# Altium project Grand Prix High Power Amp Board Rev 1.0.0.PrjPcb (part 1 of 2)
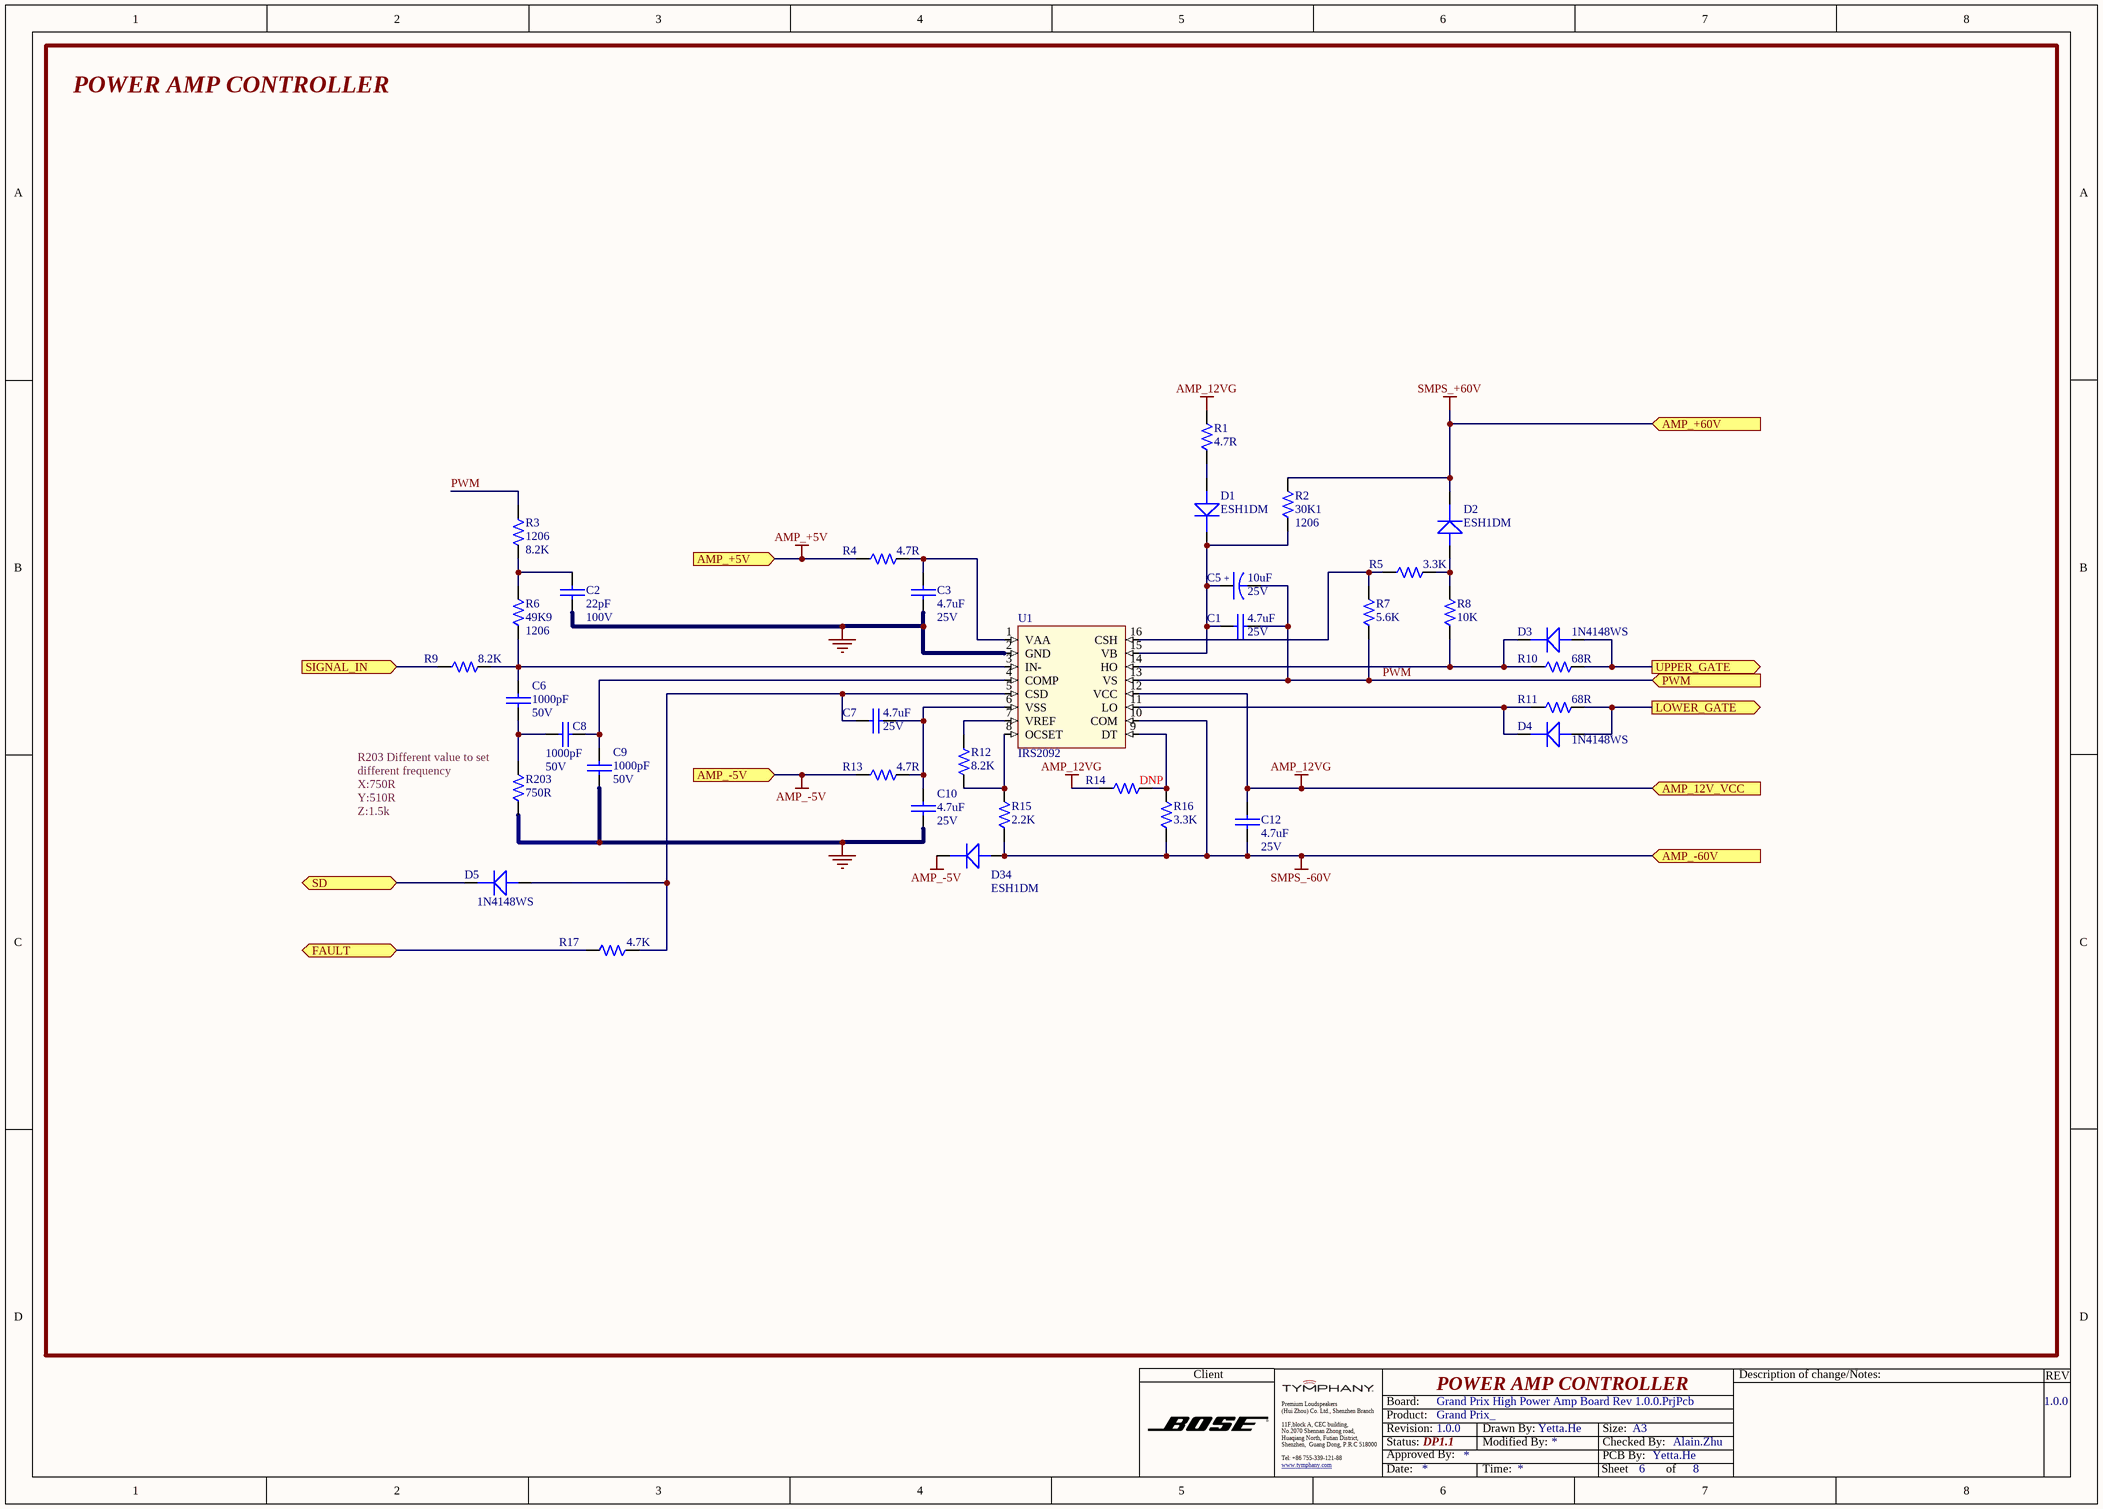
[diagram p0: IRS2092 CONTROLLER.SchDoc]
5 sheets, 276 parts. Net scope: flat (ports and power ports of the same name join across sheets).
Board file: Grand Prix L16_G2 Power Amp Board Rev 1.0.0.PcbDoc
Sheets:
  IRS2092 CONTROLLER.SchDoc
  INPUT BUFFER.SchDoc
  Amplifier & Output.SchDoc
  SMPS_LLC.SchDoc
  AMP PROTECTION.SchDoc

## Sheet IRS2092 CONTROLLER.SchDoc
size A3; CheckedBy: Alain.Zhu; CompanyName: TYMPHANY; DrawnBy: Yetta.He; Organization: PABU-BL3; Address1: 11F,block A, CEC building,; Address2: No.2070 Shennan Zhong road,; Address3: Huaqiang North, Futian District,; Address4: Shenzhen,  Guang Dong, P.R.C 518000; DocumentNumber: 6; Revision: 1.0.0; SheetNumber: 6; SheetTotal: 8; Size: A3; PCB By: Yetta.He; Status: DP1.1

### Parts
C1  value 4.7uF  Voltage: 25V  [CAPC0603-RW]  (hidden comment: T542024757408)
C2  value 22pF  Voltage: 100V  [CAPC0805-RW]  (hidden comment: PYL4103A0-2200)
C3  value 4.7uF  Voltage: 25V  [CAPC0603-RW]  (hidden comment: T542024757408)
C5  value 10uF  Voltage: 25V  [CASE - B]  (hidden comment: T551100435040)
C6  value 1000pF  Voltage: 50V  [CAPC0603-RW]  (hidden comment: PXL410370-1020)
C7  value 4.7uF  Voltage: 25V  [CAPC0603-RW]  (hidden comment: T542024757408)
C8  value 1000pF  Voltage: 50V  [CAPC0603-RW]  (hidden comment: PXL410370-1020)
C9  value 1000pF  Voltage: 50V  [CAPC0603-RW]  (hidden comment: PXL410370-1020)
C10  value 4.7uF  Voltage: 25V  [CAPC0603-RW]  (hidden comment: T542024757408)
C12  value 4.7uF  Voltage: 25V  [CAPC0603-RW]  (hidden comment: T542024757408)
D1  T571002680204  [Micro SMA]  (value not drawn)
D2  T571002680204  [Micro SMA]  (value not drawn)
D3  RCD114148-0020  [SOD-323]  (value not drawn)
D4  RCD114148-0020  [SOD-323]  (value not drawn)
D5  RCD114148-0020  [SOD-323]  (value not drawn)
D34  T571002680204  [Micro SMA]  (value not drawn)
R1  value 4.7R  [0805-RW]  (hidden comment: QCF081020-4708)
R2  value 30K1  PACKAGE: 1206  [1206-RW]  (hidden comment: T502301204399)
R3  value 8.2K  Package: 1206  [1206-RW]  (hidden comment: T502820104399)
R4  value 4.7R  [0603-RW]  (hidden comment: QCF011030-4708)
R5  value 3.3K  [0603-RW]  (hidden comment: QCF011030-3301)
R6  value 49K9  PACKAGE: 1206  [1206-RW]  (hidden comment: T502499204399)
R7  value 5.6K  [0603-RW]  (hidden comment: QCF011030-5601)
R8  value 10K  [0603-RW]  (hidden comment: QCF011030-1002)
R9  value 8.2K  [0603-RW]  (hidden comment: QCF011030-8201)
R10  value 68R  [0805-RW]  (hidden comment: QCF081020-6809)
R11  value 68R  [0805-RW]  (hidden comment: QCF081020-6809)
R12  value 8.2K  [0603-RW]  (hidden comment: QCF011030-8201)
R13  value 4.7R  [0603-RW]  (hidden comment: QCF011030-4708)
R14  value DNP  [0603-RW]  (hidden comment: RES0603 NC)
R15  value 2.2K  [0603-RW]  (hidden comment: QCF011030-2201)
R16  value 3.3K  [0603-RW]  (hidden comment: QCF011030-3301)
R17  value 4.7K  [0603-RW]  (hidden comment: QCF011030-4701)
R203  value 750R  [0603-RW]  (hidden comment: QCF011030-7500)
U1  RCI002092-0001  [SO16]  (value not drawn)

### Ports
AMP_12V_VCC (in), AMP_+5V (in), AMP_+60V (in), AMP_-5V (in), AMP_-60V (in), FAULT (bidir), LOWER_GATE (out), PWM (in), SD (bidir), SIGNAL_IN (in), UPPER_GATE (out)

### Nets
AMP_12VG: C12.1 R1.2 R14.1 U1.12(VCC) ; port AMP_12V_VCC
AMP_+5V: R4.1 ; port AMP_+5V
AMP_-5V: D34.2(K) R13.1 ; port AMP_-5V
GND: C2.2 C3.2 C9.2 C10.2 R203.1 U1.2(GND)
SMPS_+60V: D2.2(K) R2.2 ; port AMP_+60V
SMPS_-60V: C12.2 D34.1(A) R15.1 R16.1 U1.10(COM) ; port AMP_-60V
LOWER_GATE: D4.1(A) R11.2 ; port LOWER_GATE
PWM: C1.2 C5.2 R3.1 R7.1 U1.13(VS) ; port PWM
SD: D5.2(K) ; port SD
UPPER_GATE: D3.1(A) R10.2 ; port UPPER_GATE
NetC1_1: C1.1 C5.1 D1.2(K) R2.1 U1.15(VB)
NetC2_1: C2.1 R3.2 R6.2
NetC3_1: C3.1 R4.2 U1.1(VAA)
NetC6_1: C6.1 R6.1 R9.2 U1.3(IN-)
NetC6_2: C6.2 C8.1 R203.2
NetC7_1: C7.1 D5.1(A) R17.1 U1.5(CSD)
NetC7_2: C7.2 C10.1 R13.2 U1.6(VSS)
NetC8_2: C8.2 C9.1 U1.4(COMP)
NetD1_1: D1.1(A) R1.1
NetD2_1: D2.1(A) R5.2 R8.2
NetD3_2: D3.2(K) R8.1 R10.1 U1.14(HO)
NetD4_2: D4.2(K) R11.1 U1.11(LO)
NetQ32_1: R17.2 ; port FAULT
NetR5_1: R5.1 R7.2 U1.16(CSH)
NetR9_1: R9.1 ; port SIGNAL_IN
NetR12_1: R12.1 U1.7(VREF)
NetR12_2: R12.2 R15.2 U1.8(OCSET)
NetR14_2: R14.2 R16.2 U1.9(DT)

### Notes on the sheet
- POWER AMP CONTROLLER
- (near R203) R203 Different value to set different frequency
  X:750R
  Y:510R
  Z:1.5k
- Client
- Description of change/Notes:
- REV
- Premium Loudspeakers
- (Hui Zhou) Co. Ltd., Shenzhen Branch
- Tel: +86 755-339-121-88
- Board:
- Status:
- Revision:
- Product:
- Approved By:
- Grand Prix_
- Drawn By:
- Modified By:
- Checked By:
- PCB By:
- Size:
- www.tymphany.com <http://www.tymphany.com>
- Date:
- Time:
- Sheet
- of
- (in symbol CAP E 10uF 25V 20% SMD_VEJ100M1ETR-0405) +

### Library data of the parts
C1 C3 C7 C10 C12 = CAP0603 4.7uF 25V 10%_X7R_WALSIN: CAP X7R 4.7UF 25V +-10% 0603 WALSIN L; Tolerance: 10%; Type: Capacitor; CREATE_NAME: Nathan; DIP&SMD: SMD; SAP: T542024757408; PACKAGE: CAPC0603; Vendor Name: *; MFG: WALSIN; MFG Part: *; Other: X7R; CREATE_TIME: 13-July-2016; Customer Specific: N/A
C2 = CAPC0805 22pF 100V 5%_NPO_WALSIN: CAP NPO 22PF 100V +-5% 0805 WALSIN L; SAP: T541032206608; Tolerance: 5%; Type: Capacitor; DIP&SMD: SMD; CREATE_NAME: Nathan; PACKAGE: CAPC0805; Vendor Code: *; Vendor Name: *; MFG: WALSIN; MFG Part: *; Other: NPO; Customer Specific: N/A; CREATE_TIME: 06-Aug-2016
C5 = CAP E 10uF 25V 20% SMD_VEJ100M1ETR-0405: E 10UF 25V +-20% 4.3X5 VEJ100M1E; MFG: LELON; Type: Capacitor; CREATE_NAME: Cherry; CREATE_TIME: 20190401; DIP&SMD: SMD; SAP: *; MFG Part: VEJ100M1ETR-0405; Other: *; Customer Specific: N/A; PACKAGE: CASE - B
C6 C8 C9 = CAP0603 1000pF 50V 5% - PXL410370-1020: CHIP CAP 1000pF 50V 5% 0603 TYPE NPO; SAP: T541021026508; Vendor Code: 10010262; Vendor Name: 东莞市晴远电子有限公司; Type: Capacitor; DIP&SMD: SMD; PACKAGE: CAPC0603; MFG: *; MFG Part: *; Other: NPO; Tolerance: 5%; Customer Specific: N/A
D1 D2 D34 = ESH1DM: DIODE 200V 1.0A ESH1DM TSC G; Current: 1A; CREATE_NAME: Tom; DIP&SMD: SMD; MFG: TSC; SAP: T571002680204; Vendor Name: *; Vendor Code: *; Voltage: 200V; Type: DIODE; CREATE_TIME: 19-Jul-2016; Package: Micro SMA; Customer Specific: N/A; MFG Part: ESH1DM
D3-D5 = 1N4148WS: DIODE SW 1N4148 VF=0.7V SOD-323; MFG: TW SEMICONDUCTOR; SAP: T572005070208; Voltage: 100V; Current: 150MA; DIP&SMD: SMD; Vendor Name: *; Vendor Code: *; Type: DIODE; Package: SOD-323; Customer Specific: N/A; MFG Part: 1N4148WS
R1 = RES0805 1/8W 1% 4.7 OHM: GP CHIP RES 4.7 OHM 1/8W 1% 0805; Vendor Code: 10010262; SAP: T502470B03399; Vendor Name: 东莞市晴远电子有限公司; DIP&SMD: SMD; Power: 1/8W; MFG Part: *; MFG: *; TOL: 1%; Type: Resistor; PACKAGE: 0805; Customer Specific: N/A
R2 = RES1206 1/4W 1% 30.1K OHM_WALSIN: CHIP 30.1K OHM 100PPM +-1% 1206 WALS L; Power: 1/4W; MFG: WALSIN (華新); TOL: 1%; CREATE_NAME: Nathan; DIP&SMD: SMD; Vendor Code: *; SAP: T502301204399; Vendor Name: *; MFG Part: *; Type: Resistor; CREATE_TIME: 03-July-2016; Customer Specific: N/A
R3 = RES1206 1/4W 1% 8.2K OHM: CHIP 8.2K OHM 100PPM +-1% 1206 WALS L; MFG Part: WR12X8201FTL; TOL: 1%; MFG: WALSIN; Power: 1/4W; CREATE_NAME: Tom; DIP&SMD: SMD; SAP: T502820104399; Vendor Code: *; Vendor Name: *; Type: Resistor; CREATE_TIME: 12-Apr-2016; Customer Specific: N/A
R4 R13 = RES0603 1/10W 1% 4.7 OHM: CHIP RES. 4.7 OHM 1/10W 1% 0603; Vendor Code: 10010262; SAP: T502470B02399; Vendor Name: 东莞市晴远电子有限公司; DIP&SMD: SMD; Power: 1/10W; MFG Part: *; MFG: *; TOL: 1%; Type: Resistor; PACKAGE: 0603; Customer Specific: N/A
R5 R16 = RES0603 1/10W 1% 3.3K OHM: GP CHIP RES. 3.3K OHM 1/10W 1% 0603; Vendor Code: 10010262; SAP: T502330102399; Vendor Name: 东莞市晴远电子有限公司; DIP&SMD: SMD; Power: 1/10W; MFG Part: *; MFG: *; TOL: 1%; Type: Resistor; PACKAGE: 0603; Customer Specific: N/A
R6 = RES1206 1/4W 1% 49.9K OHM_WALSIN: CHIP 49.9K OHM 100PPM +-1% 1206 WALS L; Power: 1/4W; MFG: WALSIN (華新); TOL: 1%; CREATE_NAME: Nathan; DIP&SMD: SMD; Vendor Code: *; SAP: T502499204399; Vendor Name: *; MFG Part: *; Type: Resistor; CREATE_TIME: 03-July-2016; Customer Specific: N/A
R7 = RES0603 1/10W 1% 5.6K OHM: GP CHIP RES. 5.6K OHM 1/10W 1% 0603; Vendor Code: 10010262; SAP: T502560102399; Vendor Name: 东莞市晴远电子有限公司; DIP&SMD: SMD; Power: 1/10W; MFG Part: *; MFG: *; TOL: 1%; Type: Resistor; PACKAGE: 0603; Customer Specific: N/A
R8 = RES0603 1/10W 1% 10K OHM: GP CHIP RES. 10K OHM 1/10W 1% 0603; Vendor Code: 10010262; SAP: T502100202399; Vendor Name: 东莞市晴远电子有限公司; DIP&SMD: SMD; Power: 1/10W; MFG Part: *; MFG: *; TOL: 1%; Type: Resistor; PACKAGE: 0603; Customer Specific: N/A
R9 R12 = RES0603 1/10W 1% 8.2K OHM: GP CHIP RES. 8.2K OHM 1/10W 1% 0603; Vendor Code: 10010262; SAP: T502820102399; Vendor Name: 东莞市晴远电子有限公司; DIP&SMD: SMD; Power: 1/10W; MFG Part: *; MFG: *; TOL: 1%; Type: Resistor; PACKAGE: 0603; Customer Specific: N/A
R10 R11 = RES0805 1/8W 1% 68 OHM: GP CHIP RES. 68 OHM 1/8W 1% 0805; SAP: T502680A03399; MFG: WALSIN; DIP&SMD: SMD; Vendor Code: *; Power: 1/8W; Vendor Name: *; MFG Part: *; TOL: 1%; Type: Resistor; PACKAGE: 0805; Customer Specific: N/A
R14 = RES0603 NC: NC; CREATE_NAME: Tom; DIP&SMD: SMD; SAP: *; Tolerance: *; MFG Part: *; MFG: *; Vendor Code: *; Vendor Name: *; Type: Resistor; Power: *; CREATE_TIME: 18-Mar-2016; Customer Specific: N/A; Package: 0603
R15 = RES0603 1/10W 1% 2.2K OHM: GP CHIP RES. 2.2K OHM 1/10W 1% 0603; Vendor Code: 10010262; SAP: T502220102399; Vendor Name: 东莞市晴远电子有限公司; DIP&SMD: SMD; Power: 1/10W; MFG Part: *; MFG: *; TOL: 1%; Type: Resistor; PACKAGE: 0603; Customer Specific: N/A
R17 = RES0603 1/10W 1% 4.7K OHM: GP CHIP RES. 4.7K OHM 1/10W 1% 0603; Vendor Code: 10010262; SAP: T502470102399; Vendor Name: 东莞市晴远电子有限公司; DIP&SMD: SMD; Power: 1/10W; MFG: *; MFG Part: *; TOL: 1%; Type: Resistor; PACKAGE: 0603; Customer Specific: N/A
R203 = RES0603 1/10W 1% 750 OHM: GP CHIP RES. 750 OHM 1/10W 1% 0603; Vendor Code: 10010262; SAP: T502750002399; Vendor Name: 东莞市晴远电子有限公司; DIP&SMD: SMD; Power: 1/10W; MFG Part: *; MFG: *; TOL: 1%; Type: Resistor; PACKAGE: 0603; Customer Specific: N/A
U1 = IRS2092: IC 16P IRS2092S SOIC16N; MFG: IR; Vendor Code: 10020441; Vendor Name: FUTURE ELECTRONICS (HONG KONG) LIMI; SAP: T610500027638; DIP&SMD: SMD; Type: IC; Customer Specific: N/A; MFG Part: IRS2092

## Sheet INPUT BUFFER.SchDoc
size A3; CheckedBy: Alain.Zhu; CompanyName: TYMPHANY; DrawnBy: Yetta.He; Organization: PABU-BL3; Address1: 11F,block A, CEC building,; Address2: No.2070 Shennan Zhong road,; Address3: Huaqiang North, Futian District,; Address4: Shenzhen,  Guang Dong, P.R.C 518000; DocumentNumber: 5; Revision: 1.0.0; SheetNumber: 5; SheetTotal: 8; Size: A3; PCB By: Yetta.He; Status: DP1.1
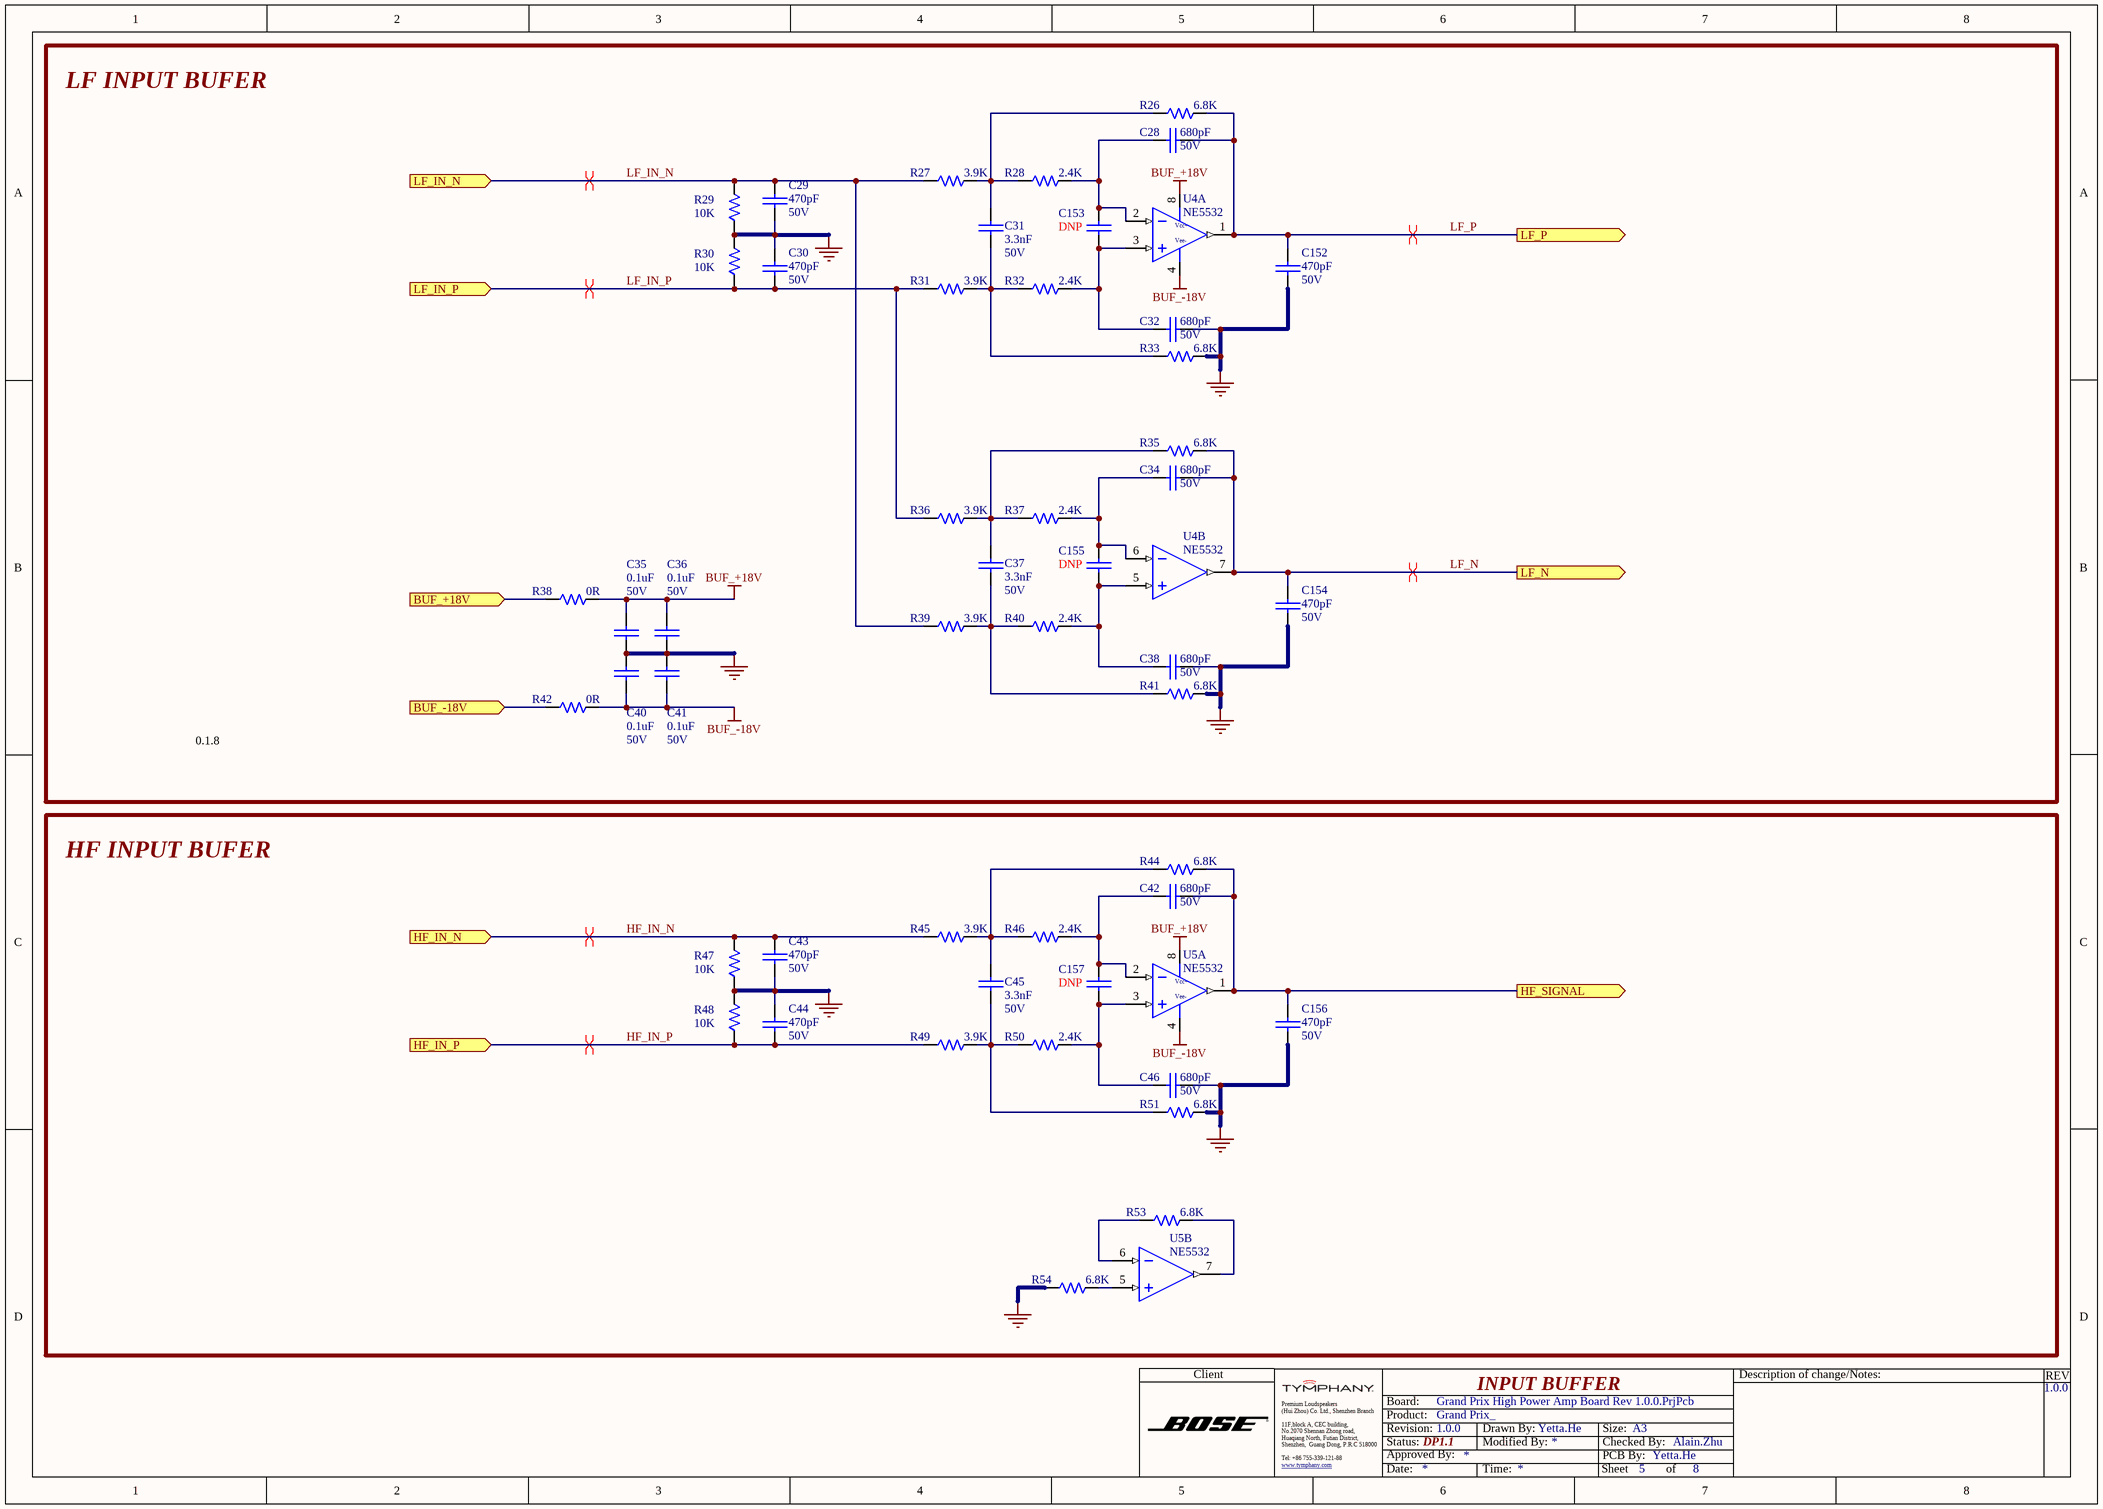
[diagram p1: INPUT BUFFER.SchDoc]

### Parts
C28  value 680pF  Voltage: 50V  [CAPC0603-RW]  (hidden comment: PXL410372-6810)
C29  value 470pF  Voltage: 50V  [CAPC0603-RW]  (hidden comment: PXL410370-4710)
C30  value 470pF  Voltage: 50V  [CAPC0603-RW]  (hidden comment: PXL410370-4710)
C31  value 3.3nF  Voltage: 50V  [CAPC0603-RW]  (hidden comment: PXL456470-3320)
C32  value 680pF  Voltage: 50V  [CAPC0603-RW]  (hidden comment: PXL410372-6810)
C34  value 680pF  Voltage: 50V  [CAPC0603-RW]  (hidden comment: PXL410372-6810)
C35  value 0.1uF  Voltage: 50V  [CAPC0603-RW]  (hidden comment: PXL456470-1040)
C36  value 0.1uF  Voltage: 50V  [CAPC0603-RW]  (hidden comment: PXL456470-1040)
C37  value 3.3nF  Voltage: 50V  [CAPC0603-RW]  (hidden comment: PXL456470-3320)
C38  value 680pF  Voltage: 50V  [CAPC0603-RW]  (hidden comment: PXL410372-6810)
C40  value 0.1uF  Voltage: 50V  [CAPC0603-RW]  (hidden comment: PXL456470-1040)
C41  value 0.1uF  Voltage: 50V  [CAPC0603-RW]  (hidden comment: PXL456470-1040)
C42  value 680pF  Voltage: 50V  [CAPC0603-RW]  (hidden comment: PXL410372-6810)
C43  value 470pF  Voltage: 50V  [CAPC0603-RW]  (hidden comment: PXL410370-4710)
C44  value 470pF  Voltage: 50V  [CAPC0603-RW]  (hidden comment: PXL410370-4710)
C45  value 3.3nF  Voltage: 50V  [CAPC0603-RW]  (hidden comment: PXL456470-3320)
C46  value 680pF  Voltage: 50V  [CAPC0603-RW]  (hidden comment: PXL410372-6810)
C152  value 470pF  Voltage: 50V  [CAPC0603-RW]  (hidden comment: PXL410370-4710)
C153  value DNP  [CAPC0603-RW]  (hidden comment: CAP0603 NC)
C154  value 470pF  Voltage: 50V  [CAPC0603-RW]  (hidden comment: PXL410370-4710)
C155  value DNP  [CAPC0603-RW]  (hidden comment: CAP0603 NC)
C156  value 470pF  Voltage: 50V  [CAPC0603-RW]  (hidden comment: PXL410370-4710)
C157  value DNP  [CAPC0603-RW]  (hidden comment: CAP0603 NC)
R26  value 6.8K  [0603-RW]  (hidden comment: QCF011030-6801)
R27  value 3.9K  [0603-RW]  (hidden comment: QCF011030-3901)
R28  value 2.4K  [0603-RW]  (hidden comment: QCF011030-2401)
R29  value 10K  [0603-RW]  (hidden comment: QCF011030-1002)
R30  value 10K  [0603-RW]  (hidden comment: QCF011030-1002)
R31  value 3.9K  [0603-RW]  (hidden comment: QCF011030-3901)
R32  value 2.4K  [0603-RW]  (hidden comment: QCF011030-2401)
R33  value 6.8K  [0603-RW]  (hidden comment: QCF011030-6801)
R35  value 6.8K  [0603-RW]  (hidden comment: QCF011030-6801)
R36  value 3.9K  [0603-RW]  (hidden comment: QCF011030-3901)
R37  value 2.4K  [0603-RW]  (hidden comment: QCF011030-2401)
R38  value 0R  [0603-RW]  (hidden comment: T502000002009)
R39  value 3.9K  [0603-RW]  (hidden comment: QCF011030-3901)
R40  value 2.4K  [0603-RW]  (hidden comment: QCF011030-2401)
R41  value 6.8K  [0603-RW]  (hidden comment: QCF011030-6801)
R42  value 0R  [0603-RW]  (hidden comment: T502000002009)
R44  value 6.8K  [0603-RW]  (hidden comment: QCF011030-6801)
R45  value 3.9K  [0603-RW]  (hidden comment: QCF011030-3901)
R46  value 2.4K  [0603-RW]  (hidden comment: QCF011030-2401)
R47  value 10K  [0603-RW]  (hidden comment: QCF011030-1002)
R48  value 10K  [0603-RW]  (hidden comment: QCF011030-1002)
R49  value 3.9K  [0603-RW]  (hidden comment: QCF011030-3901)
R50  value 2.4K  [0603-RW]  (hidden comment: QCF011030-2401)
R51  value 6.8K  [0603-RW]  (hidden comment: QCF011030-6801)
R53  value 6.8K  [0603-RW]  (hidden comment: QCF011030-6801)
R54  value 6.8K  [0603-RW]  (hidden comment: QCF011030-6801)
U4  MFG Part: NE5532  [SO8]  (hidden comment: RCI005532-0001)  (parts A,B of 2)
U5  MFG Part: NE5532  [SO8]  (hidden comment: RCI005532-0001)  (parts A,B of 2)

### Blocks framed on the sheet
LF INPUT BUFER: C28-C32 C34-C38 C40 C41 C152-C155 R26-R33 R35-R42 U4
HF INPUT BUFER: C42-C46 C156 C157 R44-R51 R53 R54 U5

### Ports
BUF_+18V (in), BUF_-18V (in), HF_IN_N (in), HF_IN_P (in), HF_SIGNAL (out), LF_IN_N (in), LF_IN_P (in), LF_N (out), LF_P (out)

### Nets
BUF_+18V: C35.1 C36.1 R38.2 U4.8 U5.8
BUF_-18V: C40.2 C41.2 R42.2 U4.4 U5.4
GND: C29.2 C30.1 C32.2 C35.2 C36.2 C38.2 C40.1 C41.1 C43.2 C44.1 C46.2 C152.2 C154.2 C156.2 R29.1 R30.2 R33.2 R41.2 R47.1 R48.2 R51.2 R54.1
HF_IN_N: C43.1 R45.1 R47.2 ; port HF_IN_N
HF_IN_P: C44.2 R48.1 R49.1 ; port HF_IN_P
LF_IN_N: C29.1 R27.1 R29.2 R39.1 ; port LF_IN_N
LF_IN_P: C30.2 R30.1 R31.1 R36.1 ; port LF_IN_P
LF_N: C34.2 C154.1 R35.2 U4.7(OUT) ; port LF_N
LF_P: C28.2 C152.1 R26.2 U4.1(OUT) ; port LF_P
NetC28_1: C28.1 C153.1 R28.2 U4.2(IN-)
NetC31_1: C31.1 R26.1 R27.2 R28.1
NetC31_2: C31.2 R31.2 R32.1 R33.1
NetC32_1: C32.1 C153.2 R32.2 U4.3(IN+)
NetC34_1: C34.1 C155.1 R37.2 U4.6(IN-)
NetC37_1: C37.1 R35.1 R36.2 R37.1
NetC37_2: C37.2 R39.2 R40.1 R41.1
NetC38_1: C38.1 C155.2 R40.2 U4.5(IN+)
NetC42_1: C42.1 C157.1 R46.2 U5.2(IN-)
NetC42_2: C42.2 C156.1 R44.2 U5.1(OUT) ; port HF_SIGNAL
NetC45_1: C45.1 R44.1 R45.2 R46.1
NetC45_2: C45.2 R49.2 R50.1 R51.1
NetC46_1: C46.1 C157.2 R50.2 U5.3(IN+)
NetR38_1: R38.1 ; port BUF_+18V
NetR42_1: R42.1 ; port BUF_-18V
NetR53_1: R53.1 U5.6(IN-)
NetR53_2: R53.2 U5.7(OUT)
NetR54_2: R54.2 U5.5(IN+)

### Layout directives
differential pair: HF_IN_N, HF_IN_P, LF_IN_N, LF_IN_P, LF_N, LF_P

### Notes on the sheet
- 0.1.8
- INPUT BUFFER
- Client
- Description of change/Notes:
- REV
- Premium Loudspeakers
- (Hui Zhou) Co. Ltd., Shenzhen Branch
- Tel: +86 755-339-121-88
- Board:
- Status:
- Revision:
- Product:
- Approved By:
- Grand Prix_
- Drawn By:
- Modified By:
- Checked By:
- PCB By:
- Size:
- www.tymphany.com <http://www.tymphany.com>
- Date:
- Time:
- Sheet
- of
- (in symbol NE5532-10020355, part A) Vcc+; Vee-

### Library data of the parts
C28 C32 C34 C38 C42 C46 = CAP0603 680pF 50V 5% - PXL410372-6810: GP CHIP CAP 680pF 50V 5% 0603 NPO; SAP: T541026816508; Vendor Code: 10010262; Vendor Name: 东莞市晴远电子有限公司; Type: Capacitor; DIP&SMD: SMD; PACKAGE: CAPC0603; MFG: *; MFG Part: *; Other: NPO; Tolerance: 5%; Customer Specific: N/A
C29 C30 C43 C44 C152 C154 C156 = CAP0603 470pF 50V 5% - PXL410370-4710: GP CHIP CAP 470pF 50V 5% 0603 NPO; SAP: T541024716508; Vendor Code: 10010262; Vendor Name: 东莞市晴远电子有限公司; MFG: Walsin; Type: Capacitor; DIP&SMD: SMD; PACKAGE: CAPC0603; MFG Part: *; Other: NPO; Tolerance: 5%; Customer Specific: N/A
C31 C37 C45 = CAP0603 3.3nF 50V 10%: GP CHIP CAP 3.3nF 50V 10% 0603 X7R; SAP: T542023327508; Vendor Code: 10010262; Vendor Name: 东莞市晴远电子有限公司; Type: Capacitor; DIP&SMD: SMD; PACKAGE: CAPC0603; MFG: *; MFG Part: *; Other: X7R; Tolerance: 10%; Customer Specific: N/A
C35 C36 C40 C41 = CAP0603 0.1uF 50V 10% - PXL456470-1040: GP CHIP CAP 0.1uF 50V 10% 0603 TYPE X7R; SAP: T542021047508; Vendor Code: 10010262; Vendor Name: 东莞市晴远电子有限公司; Type: Capacitor; DIP&SMD: SMD; PACKAGE: CAPC0603; MFG: *; MFG Part: *; Other: X7R; Tolerance: 10%; Customer Specific: N/A
C153 C155 C157 = CAP0603 NC: NC; Type: Capacitor; CREATE_NAME: Tom; DIP&SMD: SMD; SAP: *; PACKAGE: CAPC0603; Vendor Code: *; Vendor Name: *; MFG: *; MFG Part: *; Other: *; Tolerance: *; CREATE_TIME: 18-Mar-2016; Voltage: *; Customer Specific: N/A
R26 R33 R35 R41 R44 R51 R53 R54 = RES0603 1/10W 1% 6.8K OHM: GP CHIP RES. 6.8K OHM 1/10W 1% 0603; Vendor Code: 10010262; SAP: T502680102399; Vendor Name: 东莞市晴远电子有限公司; DIP&SMD: SMD; Power: 1/10W; MFG Part: *; MFG: *; TOL: 1%; Type: Resistor; PACKAGE: 0603; Customer Specific: N/A
R27 R31 R36 R39 R45 R49 = RES0603 1/10W 1% 3.9K OHM: CHIP RES. 3.9K OHM 1/10W 1% 0603; Vendor Code: 10010262; SAP: T502390102399; Vendor Name: 东莞市晴远电子有限公司; DIP&SMD: SMD; Power: 1/10W; MFG Part: *; MFG: *; TOL: 1%; Type: Resistor; PACKAGE: 0603; Customer Specific: N/A
R28 R32 R37 R40 R46 R50 = RES0603 1/10W 1% 2.4K OHM: GP CHIP RES. 2.4K OHM 1/10W 1% 0603; Vendor Code: 10010262; SAP: T502240102399; Vendor Name: 东莞市晴远电子有限公司; DIP&SMD: SMD; Power: 1/10W; MFG Part: *; MFG: *; TOL: 1%; Type: Resistor; PACKAGE: 0603; Customer Specific: N/A
R29 R30 R47 R48 = RES0603 1/10W 1% 10K OHM: as R8 on sheet IRS2092 CONTROLLER; Power: 1/10W; MFG Part: *; MFG: *; TOL: 1%; Type: Resistor; PACKAGE: 0603; Customer Specific: N/A
R38 R42 = RES0603 1/10W 0 OHM_WALSIN: CHIP 0 OHM 0 OHM 0 OHM 0603 WALSIN L; MFG Part: WR06X000PTL; Power: 1/10W; MFG: WALSIN (華新); DIP&SMD: SMD; Vendor Code: *; SAP: T502000002009; Vendor Name: *; TOL: *; Type: Resistor; PACKAGE: 0603; Customer Specific: N/A
U4 U5 = NE5532-10020355: INTEGRATED CIRCUITS NE5532 SO-8; SAP: T610500025401; MFG: TI; Vendor Name: SERIAL MICROELECTRONICS (HK) LIMITE; DIP&SMD: SMD; Vendor Code: 10020355; Type: IC; Customer Specific: N/A

## Sheet Amplifier & Output.SchDoc
size A3; CheckedBy: Alain.Zhu; CompanyName: TYMPHANY; DrawnBy: Yetta.He; Organization: PABU-BL3; Address1: 11F,block A, CEC building,; Address2: No.2070 Shennan Zhong road,; Address3: Huaqiang North, Futian District,; Address4: Shenzhen,  Guang Dong, P.R.C 518000; DocumentNumber: 7; Revision: 1.0.0; SheetNumber: 7; SheetTotal: 8; Size: A3; PCB By: Yetta.He; Status: DP1.1
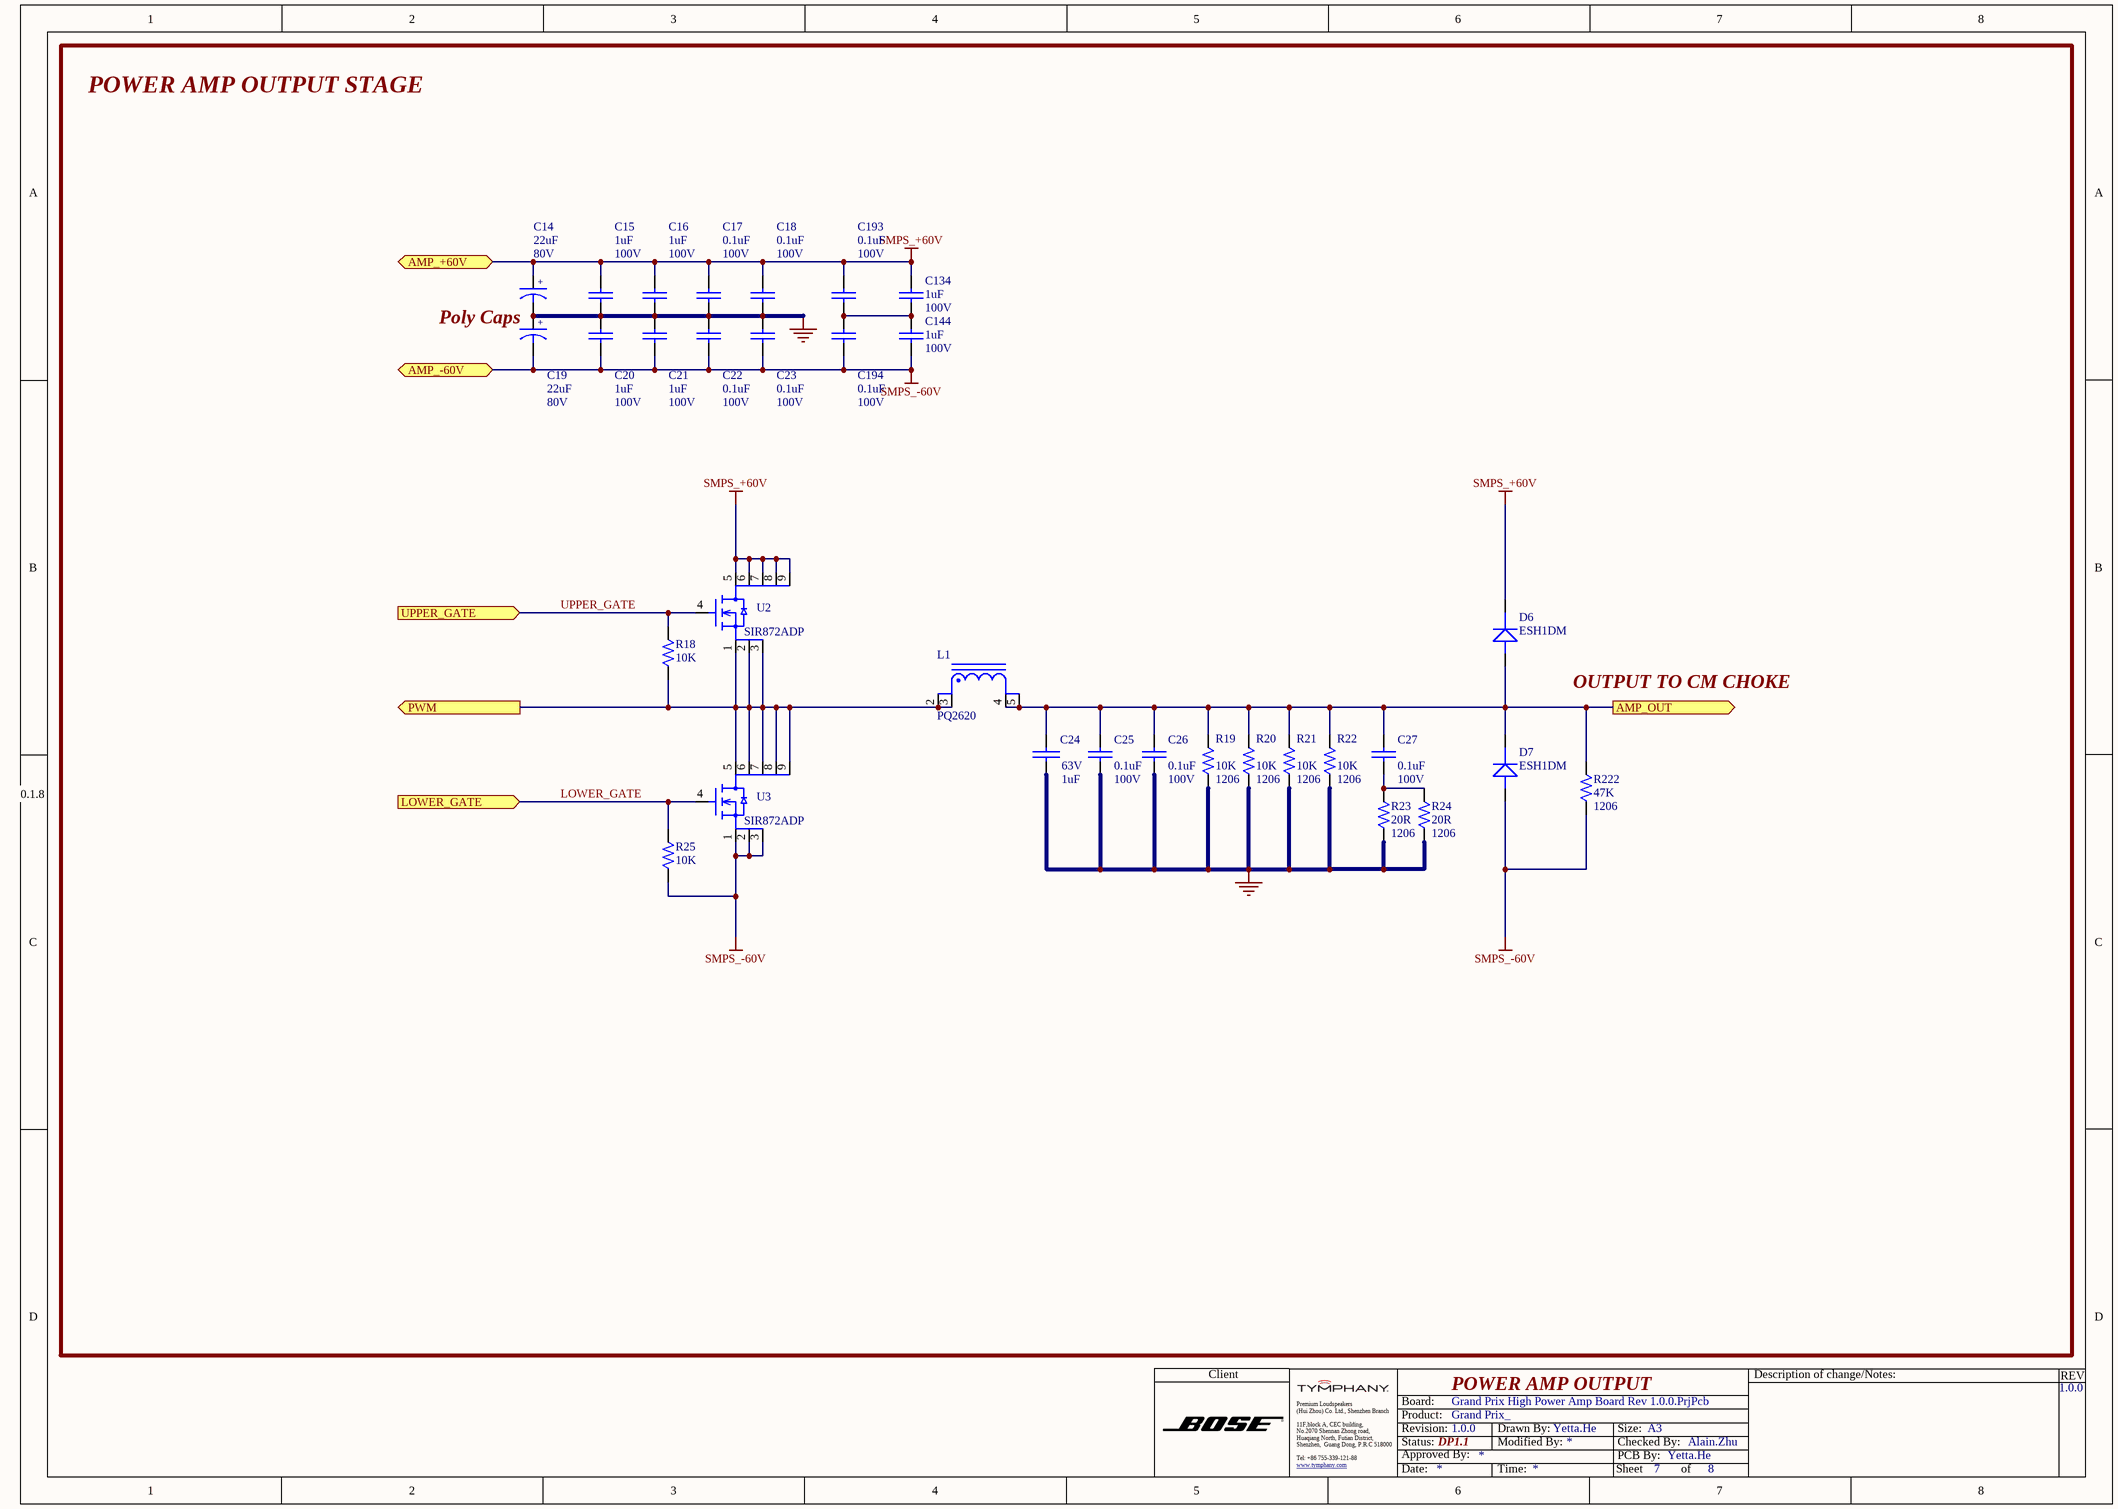
[diagram p2: Amplifier & Output.SchDoc]

### Parts
C14  value 22uF  Voltage: 80V  [CASE - F]  (hidden comment: CAP E 22uF 80V 20% SMD_HBV220M1KTR-0810)
C15  value 1uF  Voltage: 100V  [CAPC0805X125N-RW]  (hidden comment: T54000000644C)
C16  value 1uF  Voltage: 100V  [CAPC0805X125N-RW]  (hidden comment: T54000000644C)
C17  value 0.1uF  Voltage: 100V  [CAPC0603-RW]  (hidden comment: T542021047605)
C18  value 0.1uF  Voltage: 100V  [CAPC0603-RW]  (hidden comment: T542021047605)
C19  value 22uF  Voltage: 80V  [CASE - F]  (hidden comment: CAP E 22uF 80V 20% SMD_HBV220M1KTR-0810)
C20  value 1uF  Voltage: 100V  [CAPC0805X125N-RW]  (hidden comment: T54000000644C)
C21  value 1uF  Voltage: 100V  [CAPC0805X125N-RW]  (hidden comment: T54000000644C)
C22  value 0.1uF  Voltage: 100V  [CAPC0603-RW]  (hidden comment: T542021047605)
C23  value 0.1uF  Voltage: 100V  [CAPC0603-RW]  (hidden comment: T542021047605)
C24  value 1uF  Voltage: 63V  [1uF 63V TDK MKP]  (hidden comment: CAP E MKP 1uF 63V 5%)
C25  value 0.1uF  Voltage: 100V  [CAPC0603-RW]  (hidden comment: T542021047605)
C26  value 0.1uF  Voltage: 100V  [CAPC0603-RW]  (hidden comment: T542021047605)
C27  value 0.1uF  Voltage: 100V  [CAPC0603-RW]  (hidden comment: T542021047605)
C134  value 1uF  Voltage: 100V  [CAPC0805X125N-RW]  (hidden comment: T54000000644C)
C144  value 1uF  Voltage: 100V  [CAPC0805X125N-RW]  (hidden comment: T54000000644C)
C193  value 0.1uF  Voltage: 100V  [CAPC0603-RW]  (hidden comment: T542021047605)
C194  value 0.1uF  Voltage: 100V  [CAPC0603-RW]  (hidden comment: T542021047605)
D6  T571002680204  [Micro SMA]  (value not drawn)
D7  T571002680204  [Micro SMA]  (value not drawn)
L1  PQ2620  [PQ2620]
R18  value 10K  [0603-RW]  (hidden comment: QCF011030-1002)
R19  value 10K  PACKAGE: 1206  [1206-RW]  (hidden comment: QCF041010-1002)
R20  value 10K  PACKAGE: 1206  [1206-RW]  (hidden comment: QCF041010-1002)
R21  value 10K  PACKAGE: 1206  [1206-RW]  (hidden comment: QCF041010-1002)
R22  value 10K  PACKAGE: 1206  [1206-RW]  (hidden comment: QCF041010-1002)
R23  value 20R  PACKAGE: 1206  [1206-RW]  (hidden comment: QCF041011-2009)
R24  value 20R  PACKAGE: 1206  [1206-RW]  (hidden comment: QCF041011-2009)
R25  value 10K  [0603-RW]  (hidden comment: QCF011030-1002)
R222  value 47K  PACKAGE: 1206  [1206-RW]  (hidden comment: QCF041010-4702)
U2  RCM000872-1001  [DFN8(5X6)]  (value not drawn)
U3  RCM000872-1001  [DFN8(5X6)]  (value not drawn)

### Ports
AMP_+60V (bidir), AMP_-60V (bidir), AMP_OUT (out), LOWER_GATE (in), PWM (out), UPPER_GATE (in)

### Nets
GND: C14.2 C15.2 C16.2 C17.2 C18.2 C19.1 C20.1 C21.1 C22.1 C23.1 C24.2 C25.2 C26.2 R19.1 R20.1 R21.1 R22.1 R23.1 R24.1
SMPS_+60V: C14.1 C15.1 C16.1 C17.1 C18.1 C134.1 C193.1 D6.2(K) U2.5(D) U2.6(D) U2.7(D) U2.8(D) U2.9(D) ; port AMP_+60V
SMPS_-60V: C19.2 C20.2 C21.2 C22.2 C23.2 C144.2 C194.2 D7.1(A) R25.1 R222.1 U3.1(S) U3.2(S) U3.3(S) ; port AMP_-60V
LOWER_GATE: R25.2 U3.4(G) ; port LOWER_GATE
PWM: L1.2 L1.3 R18.1 U2.1(S) U2.2(S) U2.3(S) U3.5(D) U3.6(D) U3.7(D) U3.8(D) U3.9(D) ; port PWM
UPPER_GATE: R18.2 U2.4(G) ; port UPPER_GATE
NetC24_1: C24.1 C25.1 C26.1 C27.1 D6.1(A) D7.2(K) L1.4 L1.5 R19.2 R20.2 R21.2 R22.2 R222.2 ; port AMP_OUT
NetC27_2: C27.2 R23.2 R24.2
NetC134_2: C134.2 C144.1 C193.2 C194.1

### Notes on the sheet
- POWER AMP OUTPUT STAGE
- Poly Caps
- OUTPUT TO CM CHOKE
- 0.1.8
- POWER AMP OUTPUT
- Client
- Description of change/Notes:
- REV
- Premium Loudspeakers
- (Hui Zhou) Co. Ltd., Shenzhen Branch
- Tel: +86 755-339-121-88
- Board:
- Status:
- Revision:
- Product:
- Approved By:
- Grand Prix_
- Drawn By:
- Modified By:
- Checked By:
- PCB By:
- Size:
- www.tymphany.com <http://www.tymphany.com>
- Date:
- Time:
- Sheet
- of
- (in symbol CAP E 22uF 80V 20% SMD_HBV220M1KTR-0810) +

### Library data of the parts
C14 C19 = CAP E 22uF 80V 20% SMD_HBV220M1KTR-0810: E 22UF 80V +-20% 8*10 HBV220M1KTR-0810; SAP: T5512204C5010; Type: Capacitor; DIP&SMD: SMD; CREATE NAME: Cherry; PACKAGE: CASE - F; Vendor Name: *; Vendor Code: *; MFG: *; MFG Part: HBV220M1KTR-0810; Other: *; Tolerance: 20%; Customer Specific: N/A; CREATE TIME: 2019-04-01
C15 C16 C20 C21 C134 C144 = CAPC0805 1uF 100V 10%_X7S_TDK: CAP 1.0UF 100V +-10% 0805X7S TDK L; Other: X7S; Tolerance: 10%; Type: Capacitor; CREATE_NAME: Nathan; DIP&SMD: SMD; SAP: T54000000644C; PACKAGE: CAPC0805; Vendor Code: *; Vendor Name: *; MFG: TDK; MFG Part: *; CREATE_TIME: 06-Aug-2016; Customer Specific: N/A
C17 C18 C22 C23 C25-C27 C193 C194 = CAP0603 0.1uF 100V 10%_X7R_MURATA: CAP X7R .10UF 100V +-10% 0603 MURATA L; Tolerance: 10%; Type: Capacitor; CREATE_NAME: Nathan; DIP&SMD: SMD; SAP: T542021047605; PACKAGE: CAPC0603; MFG: MURATA; MFG Part: *; Other: X7R; CREATE_TIME: 02-Aug-2016; Customer Specific: N/A; Vendor Name: *
C24 = CAP E MKP 1uF 63V 5%: PLS-DIP 1UF 63V +-5% T B32529C0 K; SAP: T564105208020; MFG: TDK; CREATE_NAME: Yetta; Type: Capacitor; DIP&SMD: DIP; PACKAGE: 1uF/63V; Vendor Name: *; Vendor Code: *; MFG Part: B32529C0; Other: *; Tolerance: 5%; CREATE_TIME: 23-NOV-2018; Customer Specific: N/A
D6 D7 = ESH1DM: as D1 on sheet IRS2092 CONTROLLER; MFG: TSC; SAP: T571002680204; Vendor Name: *; Vendor Code: *; Voltage: 200V; Type: DIODE; CREATE_TIME: 19-Jul-2016; Package: Micro SMA; Customer Specific: N/A; MFG Part: ESH1DM
L1 = PQ2620: INDUCTOR 11uH; MFG: Gloria; Tolerance: 10%; DIP&SMD: DIP; Value: 11uH; Current: *; Type: INDUCTOR; MFG Part: PQ2620
R18 R25 = RES0603 1/10W 1% 10K OHM: as R8 on sheet IRS2092 CONTROLLER; Power: 1/10W; MFG Part: *; MFG: *; TOL: 1%; Type: Resistor; PACKAGE: 0603; Customer Specific: N/A
R19-R22 = RES1206 1/4W 1% 10K OHM: GP CHIP RES. 10K OHM 1/4  W 1% TF 1206; Vendor Code: 10010262; SAP: T502100204399; Power: 1/4W; Vendor Name: 东莞市晴远电子有限公司; DIP&SMD: SMD; MFG Part: *; MFG: *; TOL: 1%; Type: Resistor; Customer Specific: N/A
R23 R24 = RES1206 1/4W 1% 20 OHM: CHIP 20 OHM 100PPM +-1% 1206 WALS L; Vendor Code: 10010262; SAP: T502200A04399; Power: 1/4W; Vendor Name: 东莞市晴远电子有限公司; MFG: WALSIN (華新); TOL: 1%; DIP&SMD: SMD; MFG Part: *; Type: Resistor; Customer Specific: N/A
R222 = RES1206 1/4W 1% 47K OHM: CHIP RES. 47K OHM 1206 1%; Vendor Code: 10010262; SAP: T502470204399; Power: 1/4W; Vendor Name: 东莞市晴远电子有限公司; DIP&SMD: SMD; MFG Part: *; MFG: *; TOL: 1%; Type: Resistor; Customer Specific: N/A
U2 U3 = SIR872ADP: N-Channel  MOSFET SO-8 SiR872ADP 150V(D-S); MFG: VISHAY; SAP: T586002791835; CREATE_NAME: Nathan; Current: 53.7A; Power: 104W; Vendor Code: *; Vendor Name: *; Type: N-Channel MOSFET; CREATE_TIME: 21-Nov-2014; Voltage: 150V; Package: DFN8(5X6); MFG Part: SIR872ADP